# EAGLE design SLIM-IFA-33-R1 (EAGLE 5.11)
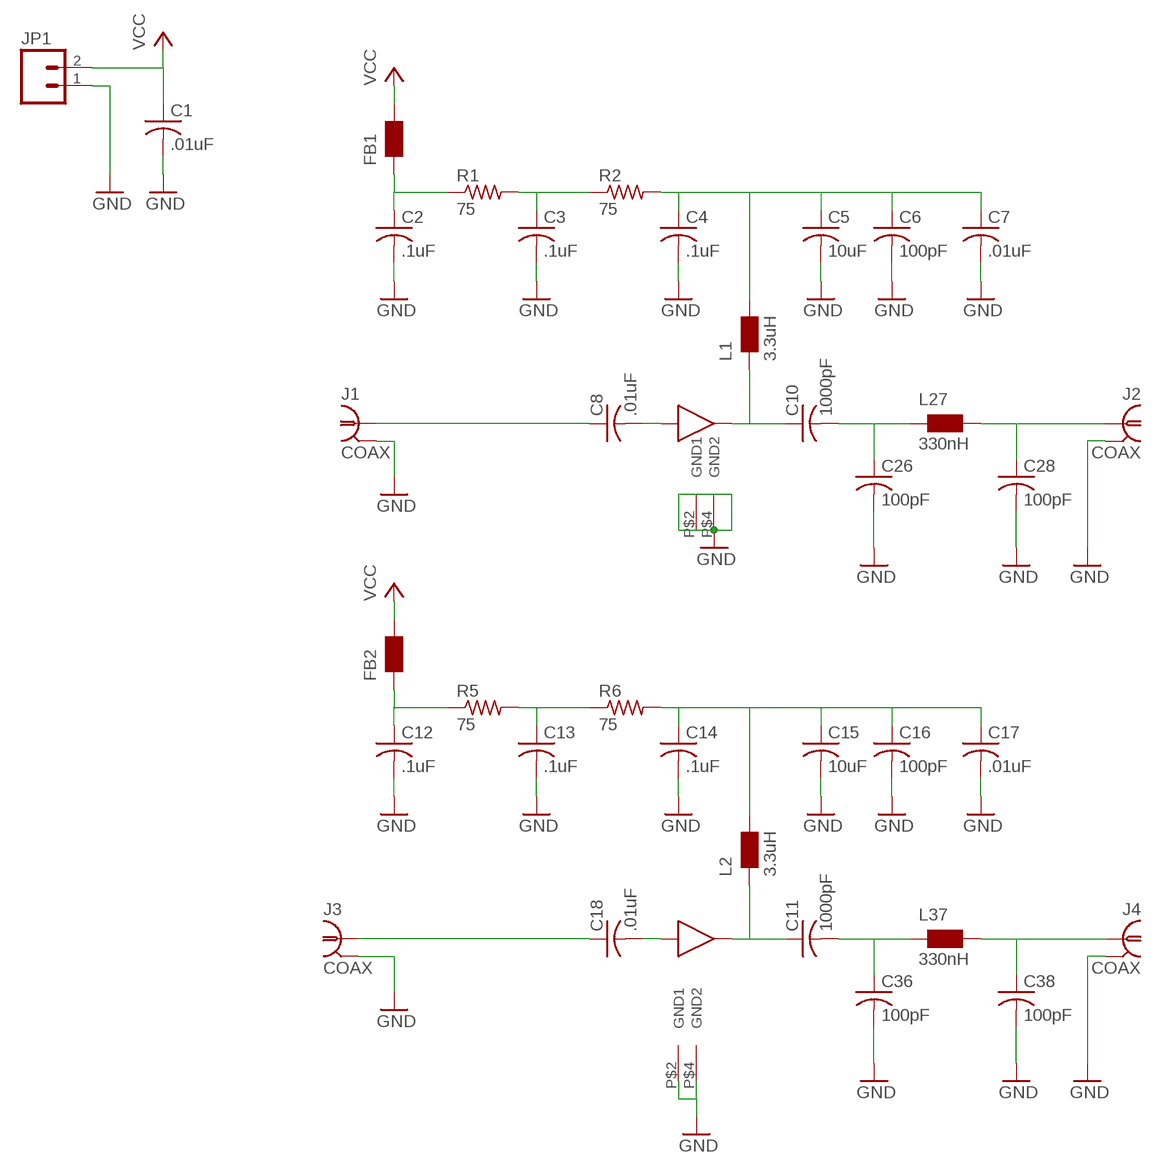
[diagram p0: schematic, sheet 1]

## Parts
C1  .01uF  C-USC0805  [C0805]
C2  .1uF  C-USC0805  [C0805]
C3  .1uF  C-USC0805  [C0805]
C4  .1uF  C-USC0805  [C0805]
C5  10uF  C-USC1206  [C1206]
C6  100pF  C-USC0805  [C0805]
C7  .01uF  C-USC0805  [C0805]
C8  .01uF  C-USC0805  [C0805]
C10  1000pF  C-USC0805  [C0805]
C11  1000pF  C-USC0805  [C0805]
C12  .1uF  C-USC0805  [C0805]
C13  .1uF  C-USC0805  [C0805]
C14  .1uF  C-USC0805  [C0805]
C15  10uF  C-USC1206  [C1206]
C16  100pF  C-USC0805  [C0805]
C17  .01uF  C-USC0805  [C0805]
C18  .01uF  C-USC0805  [C0805]
C26  100pF  C-USC0805  [C0805]
C28  100pF  C-USC0805  [C0805]
C36  100pF  C-USC0805  [C0805]
C38  100pF  C-USC0805  [C0805]
FB1  WE-CBF_0805  [0805]
FB2  WE-CBF_0805  [0805]
J1  COAX  [SLIM_COAX_PAD]
J2  COAX  [SLIM_COAX_PAD]
J3  COAX  [SLIM_COAX_PAD]
J4  COAX  [SLIM_COAX_PAD]
JP1  M02POLAR  [MOLEX-1X2]
L1  3.3uH  WE-CBF_0805  [0805]
L2  3.3uH  WE-CBF_0805  [0805]
L27  330nH  WE-CBF_0805  [0805]
L37  330nH  WE-CBF_0805  [0805]
R1  75  R-US_R0805  [R0805]
R2  75  R-US_R0805  [R0805]
R5  75  R-US_R0805  [R0805]
R6  75  R-US_R0805  [R0805]
U1  ERA-33  [WW107]
U2  ERA-33  [WW107]

## Nets
GND: C1.2 C2.2 C3.2 C4.2 C5.2 C6.2 C7.2 C12.2 C13.2 C14.2 C15.2 C16.2 C17.2 C26.2 C28.2 C36.2 C38.2 J1.P$2(GND) J2.P$2(GND) J3.P$2(GND) J4.P$2(GND) JP1.1 U1.P$2(GND1) U1.P$4(GND2) U2.P$2(GND1) U2.P$4(GND2)
N$1: C2.1 FB1.1 R1.1
N$2: C3.1 R1.2 R2.1
N$3: C4.1 C5.1 C6.1 C7.1 L1.2 R2.2
N$4: C8.1 J1.P$1
N$7: C10.1 L1.1 U1.P$3(RF_OUT)
N$8: C10.2 C26.1 L27.1
N$9: C28.1 J2.P$1 L27.2
N$10: C8.2 U1.P$1(RF_IN)
N$11: C12.1 FB2.1 R5.1
N$12: C13.1 R5.2 R6.1
N$13: C14.1 C15.1 C16.1 C17.1 L2.2 R6.2
N$14: C18.1 J3.P$1
N$17: C11.1 L2.1 U2.P$3(RF_OUT)
N$18: C11.2 C36.1 L37.1
N$19: C38.1 J4.P$1 L37.2
N$20: C18.2 U2.P$1(RF_IN)
VCC: C1.1 FB1.2 FB2.2 JP1.2

## Library data of the parts
C1-C8 C10-C18 C26 C28 C36 C38 = rcl:C-US: CAPACITOR, American symbol
FB1 FB2 L1 L2 L27 L37 = wuerth-elektronik:WE-CBF: SMD EMI Suppression Ferrite Beads - excellent anti-EMI properties - low DCR - impedances till 3000 ohms - rated current up to 6 A
J1-J4 = SLIM:COAX
JP1 = SparkFun:M02: Header 2 Standard 2-pin 0.1" header. Use with straight break away headers (SKU : PRT-00116), right angle break away headers (PRT-00553), swiss pins (PRT-00743), machine pins (PRT-00117), and female headers (PRT-00115). Molex polarized connector foot print use with SKU : PRT-08233 with associated crimp pins and housings.
R1 R2 R5 R6 = rcl:R-US_: RESISTOR, American symbol
U1 U2 = Minicircuits:ERA-33

## Board
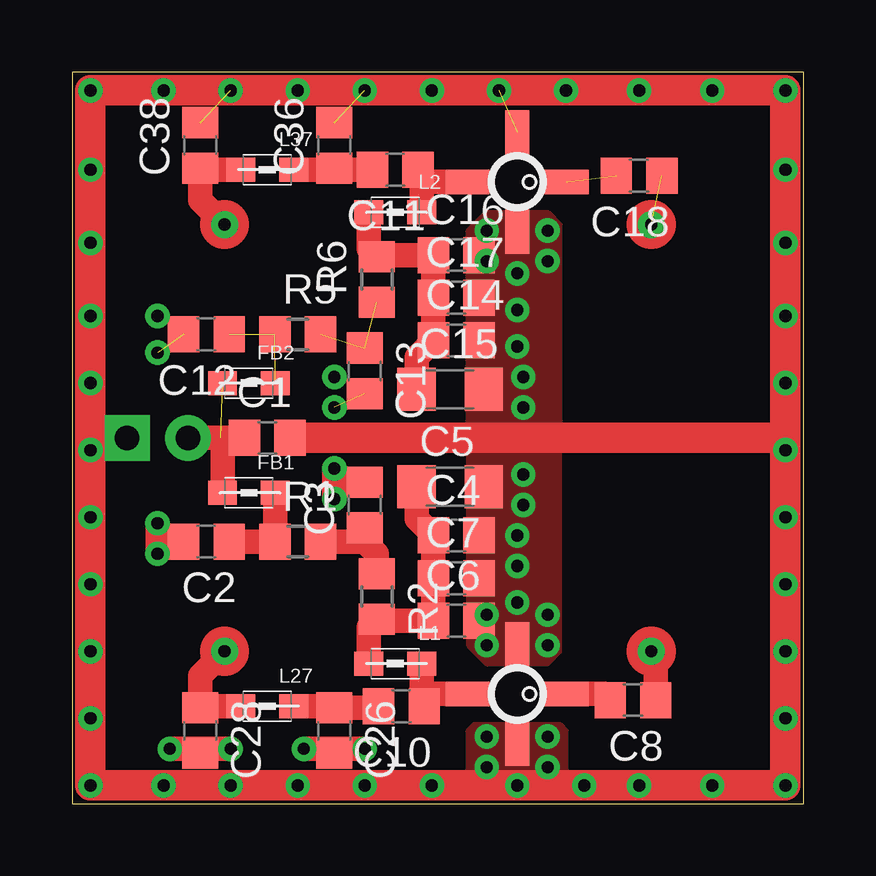
[diagram p1: board, top side]
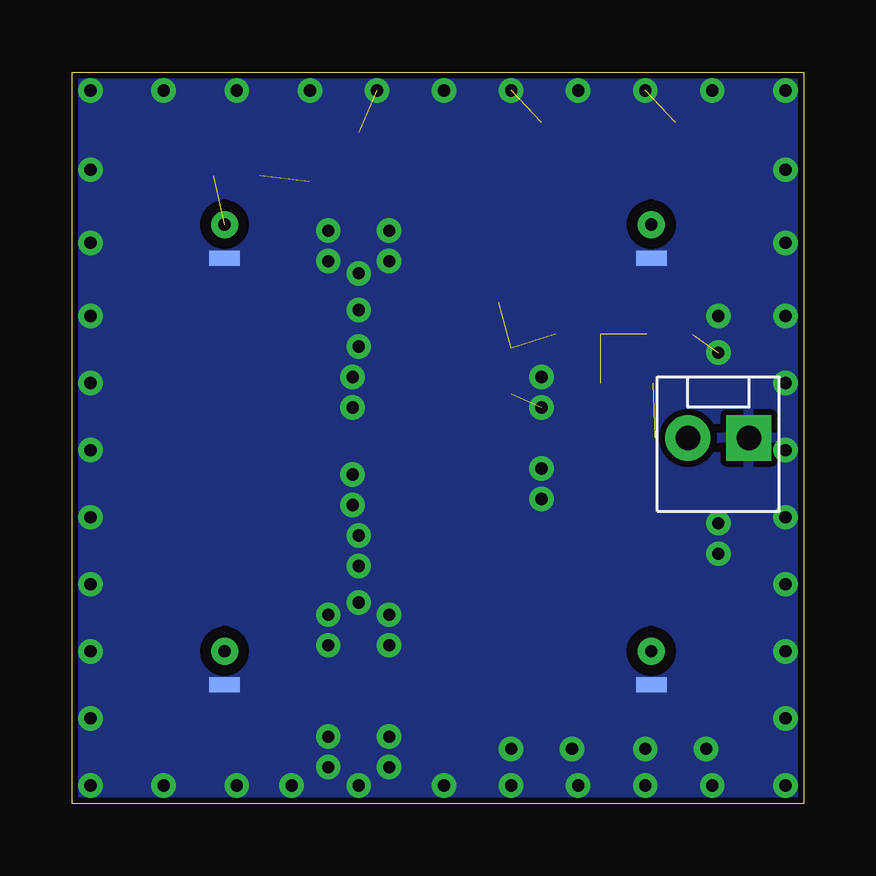
[diagram p2: board, bottom side, seen from below]

Size 30.48 x 30.48 mm. Coordinates in mm from the lower left corner, seen from the top.
Outline: 0,0 30.48,0 30.48,30.48 0,30.48 0,0
Copper layers (1*16): Top 0.035mm / dielectric 1.5mm / Bottom 0.035mm
Design rules "SparkFun": minimum track width 8mil, minimum drill 20mil, track to track 8mil, track to pad 8mil, pad to pad 8mil, via to via 8mil, smd to smd 8mil, copper to edge 10mil, drill to drill 8mil, minimum pad ring 12mil, minimum via ring 10mil, stop-mask expansion 4mil, vias tented up to drill 25mil, thermal gap 10mil

### Footprints (pad centres in the part's own frame; a part is rotated, then mirrored left to right if it is on the bottom)
C0805 = smd 1.3 x 1.5: 1 -0.95,0; 2 0.95,0
C1206 = smd 1.6 x 1.8: 1 -1.4,0; 2 1.4,0
0805 = smd 1.2 x 1: 1 -1.1,0; 2 1.1,0
SLIM_COAX_PAD = drill 0.508 pad 1.016 round: P$1 0,0 | smd 1.27 x 0.635 bottom: P$2 0,-1.397
MOLEX-1X2 = drill 1.016 pad 1.88 square: 1 0,0 | drill 1.016 pad 1.88 round: 2 2.54,0
R0805 = smd 1.3 x 1.5: 1 -0.95,0; 2 0.95,0
WW107 = smd 1.016 x 1.829: P$1 0,-2.07; P$3 0,2.07 | smd 1.829 x 1.016: P$2 2.07,0; P$4 -2.07,0

### Placement (x,y rotation side)
C1  8.13,15.24 0 top
C2  5.59,10.92 180 top
C3  12.19,12.45 90 top
C4  16,11.18 0 top
C5  15.75,13.21 0 top
C6  16,7.62 0 top
C7  16,9.4 0 top
C8  23.37,4.32 180 top
C10  13.72,4.06 180 top
C11  13.46,26.42 180 top
C12  5.59,19.56 180 top
C13  12.19,18.03 270 top
C14  16,19.3 0 top
C15  15.75,17.27 0 top
C16  16,22.86 0 top
C17  16,21.08 0 top
C18  23.62,26.16 180 top
C26  10.92,3.05 270 top
C28  5.33,3.05 270 top
C36  10.92,27.43 90 top
C38  5.33,27.43 90 top
FB1  7.37,12.95 180 top
FB2  7.37,17.53 180 top
J1  24.13,6.35 0 top
J2  6.35,6.35 0 top
J3  24.13,24.13 0 top
J4  6.35,24.13 0 top
JP1  2.29,15.24 180 bottom
L1  13.46,5.84 180 top
L2  13.46,24.64 180 top
L27  8.13,4.06 180 top
L37  8.13,26.42 180 top
R1  9.4,10.92 0 top
R2  12.7,8.64 270 top
R5  9.4,19.56 0 top
R6  12.7,21.84 90 top
U1  18.54,4.57 90 top
U2  18.54,25.91 90 top

### Tracks (layer width: path | path; a pad name or v marks a point on that pad's centre or on a via)
GND  (via drill 0.51)  (5 unrouted)
  Top 1.016: v4.06,2.29 5.33,2.29 | 5.33,2.29 v6.6,2.29 | 5.33,2.29 C28.2 | v9.65,2.29 11.18,2.29 | 11.18,2.29 v12.19,2.29 | C26.2 10.99,2.1 11.18,2.29 | 3.56,10.92 v3.56,10.41 | 3.56,10.92 v3.56,11.68 | C2.2 3.56,10.92 | 10.92,13.46 v10.92,13.97 | 10.92,13.46 v10.92,12.7 | C3.2 10.99,13.4 10.92,13.46
  Top 1.27: 29.72,15.24 v29.72,0.76 v0.76,0.76 v0.76,29.72 v29.72,29.72 29.72,15.24 | 29.72,15.24 C1.2
  other vias: 3.81,29.72 6.6,29.72 26.67,29.72 12.19,29.72 9.4,29.72 14.99,29.72 17.78,29.72 23.62,29.72 0.76,3.56 0.76,6.35 0.76,26.42 0.76,11.94 0.76,9.14 0.76,14.73 0.76,17.53 0.76,20.32 0.76,23.37 29.72,3.56 29.72,26.42 29.72,11.94 29.72,14.73 29.72,20.32 29.72,23.37 3.81,0.76 6.6,0.76 26.67,0.76 12.19,0.76 9.4,0.76 14.99,0.76 18.54,0.76 21.34,0.76 23.62,0.76 20.57,29.72 29.72,17.53 29.72,9.14 29.72,6.35 19.81,6.6 19.81,7.87 18.54,8.38 17.27,6.6 17.27,7.87 17.27,2.79 17.27,1.52 19.81,1.52 19.81,2.79 18.54,9.91 18.54,11.18 18.8,12.45 18.8,13.72 19.81,23.88 19.81,22.61 18.54,22.1 17.27,23.88 17.27,22.61 18.54,20.57 18.54,19.05 18.8,17.78 18.8,16.51 10.92,17.78 10.92,16.51 3.56,20.32 3.56,18.8
  pour Bottom (isolate 0.254): 0,30.48 30.48,30.48 30.48,0 0,0
  pour Top (no thermals): 16.51,14.73 16.51,6.6 17.27,5.84 19.81,5.84 20.32,6.35 20.32,14.73
  pour Top (no thermals): 16.76,3.3 20.32,3.3 20.57,3.05 20.57,1.27 16.51,1.27 16.51,3.05
  pour Top (no thermals): 16.51,15.75 16.51,23.88 17.27,24.64 19.81,24.64 20.32,24.13 20.32,15.75
N$1
  Top 1.016: C2.1 R1.1 8.47,10.94 FB1.1
N$2
  Top 1.016: 12.19,10.92 R1.2 | 12.19,10.92 C3.1 | R2.1 12.7,10.41 12.19,10.92
N$3
  Top 1.016: C5.1 14.35,11.88 C4.1 C7.1 C6.1 12.77,7.62 R2.2 12.36,7.35 L1.2
N$4
  Top 1.016: C8.1 24.32,6.16 J1.P$1
N$7
  Top 1.016: 14.56,4.57 14.56,4.17 C10.1 | 14.56,4.57 L1.1 | 14.56,4.57 U1.P$3
N$8
  Top 1.016: L27.1 10.86,4.06 C26.1 12.7,4 C10.2
N$9
  Top 1.016: J2.P$1 5.33,5.33 C28.1 5.4,4.06 L27.2
N$10
  Top 1.016: U1.P$1 22.16,4.57 C8.2
N$11  (2 unrouted)
N$12  (2 unrouted)
N$13
  Top 1.016: L2.2 12.36,23.13 R6.2 12.77,22.86 C16.1 C17.1 C14.1 14.35,18.6 C15.1
N$14  (1 unrouted)
N$17
  Top 1.016: L2.1 14.56,25.91 | 14.56,25.91 14.56,26.27 C11.1 | 14.56,25.91 U2.P$3
N$18
  Top 1.016: L37.1 10.92,26.42 | 10.92,26.42 C11.2 | 10.92,26.42 C36.1
N$19
  Top 1.016: J4.P$1 5.33,25.15 C38.1 5.4,26.42 L37.2
N$20  (1 unrouted)
VCC  (1 unrouted)
  Top 1.016: FB1.2 6.27,15.16 | 6.27,15.16 6.35,15.24 C1.1 | JP1.2 6.18,15.24 6.27,15.16